# EAGLE design Dual_555_Police_Strobe (EAGLE 9.4.2)
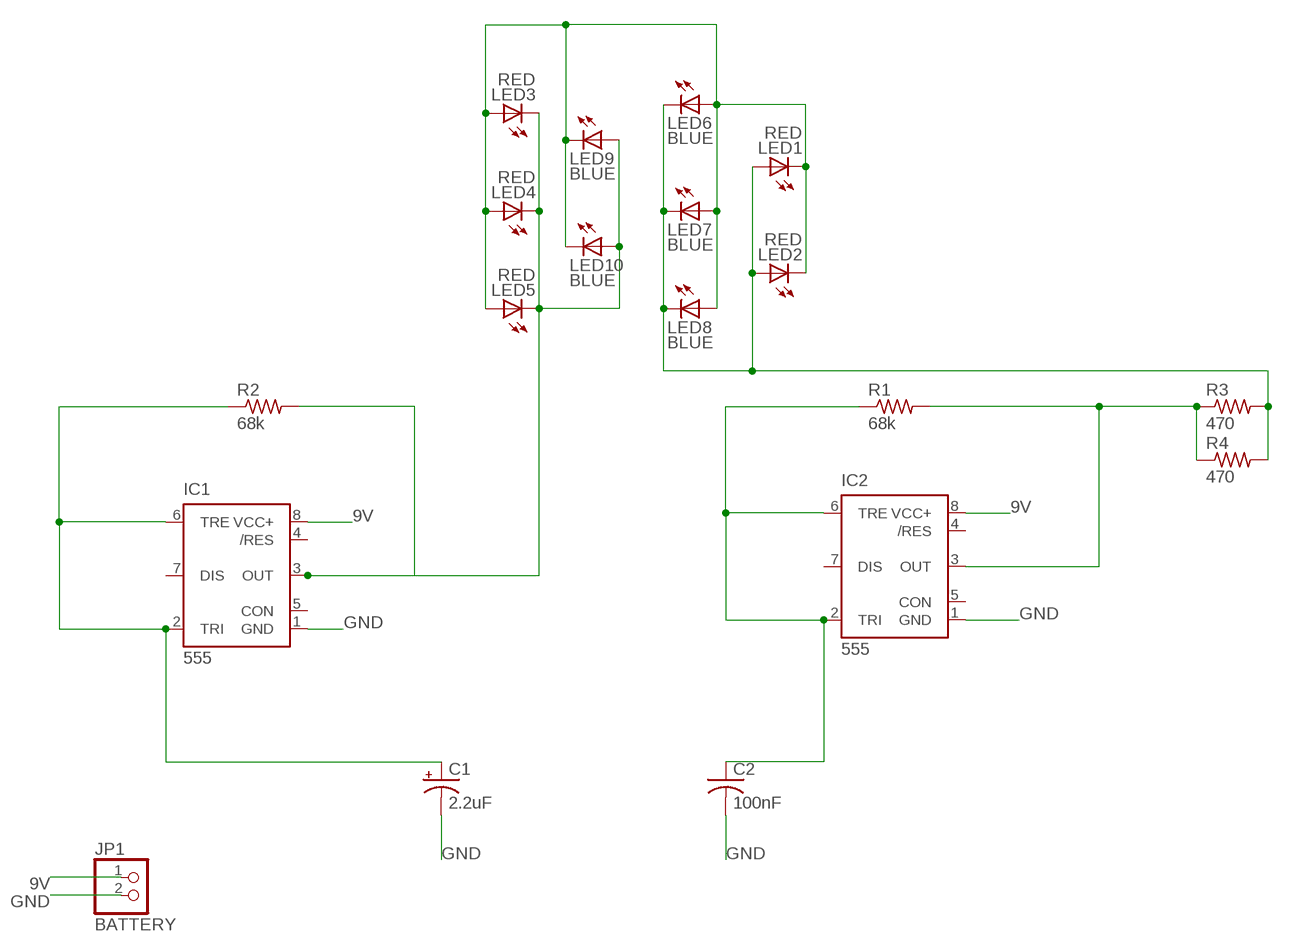
[diagram p0: schematic, sheet 1]

## Parts
C1  2.2uF  CPOL-USE2.5-6  [E2,5-6]
C2  100nF  C-US025-050X050  [C025-050X050]
IC1  555  555P  [DIP08]
IC2  555  555P  [DIP08]
JP1  BATTERY  PINHD-1X2  [1X02]
LED1  RED  LED5MM  [LED5MM]
LED2  RED  LED5MM  [LED5MM]
LED3  RED  LED5MM  [LED5MM]
LED4  RED  LED5MM  [LED5MM]
LED5  RED  LED5MM  [LED5MM]
LED6  BLUE  LED5MM  [LED5MM]
LED7  BLUE  LED5MM  [LED5MM]
LED8  BLUE  LED5MM  [LED5MM]
LED9  BLUE  LED5MM  [LED5MM]
LED10  BLUE  LED5MM  [LED5MM]
R1  68k  R-US_0207/10  [0207/10]
R2  68k  R-US_0207/10  [0207/10]
R3  470  R-US_0207/10  [0207/10]
R4  470  R-US_0207/10  [0207/10]

## Nets
9V: IC1.8(VCC+) IC2.8(VCC+) JP1.1
GND: C1.- C2.2 IC1.1(GND) IC2.1(GND) JP1.2
N$1: C1.+ IC1.2(TRI) IC1.6(TRE) R2.1
N$3: C2.1 IC2.2(TRI) IC2.6(TRE) R1.1
N$4: IC1.3(OUT) LED3.K(C) LED4.K(C) LED5.K(C) LED9.A LED10.A R2.2
N$5: LED1.A LED2.A LED6.K(C) LED7.K(C) LED8.K(C) R3.2 R4.2
N$6: IC2.3(OUT) R1.2 R3.1 R4.1
N$8: LED1.K(C) LED2.K(C) LED3.A LED4.A LED5.A LED6.A LED7.A LED8.A LED9.K(C) LED10.K(C)
Unconnected: IC1.4(/RES) IC1.5(CON) IC1.7(DIS) IC2.4(/RES) IC2.5(CON) IC2.7(DIS)

## Library data of the parts
C1 = adafruit:CPOL-US: POLARIZED CAPACITOR, American symbol
C2 = adafruit:C-US: CAPACITOR, American symbol
IC1 IC2 = SparkFun-IC-Special-Function:555: General purpose bipolar Timer Datasheet <http://www.sparkfun.com/datasheets/Components/General/ne555.pdf> SparkFun Products SparkFun SparkPunk Sequencer Kit <https://www.sparkfun.com/products/12707> (KIT-12707) Storefront Component: 555 Timer <https://www.sparkfun.com/products/9273> (COM-09273) Two parts valid for production: VFP: IC-11930 (M7555 PTH) VFP: IC-09173 (555 PTH) - Preferred; PROD_ID: IC-09173; PROD_ID_ALT: IC-09173
JP1 = pinhead:PINHD-1X2: PIN HEADER
LED1-LED10 = adafruit_copy:LED: LED OSRAM: - CHIPLED LG R971, LG N971, LY N971, LG Q971, LY Q971, LO R971, LY R971 LH N974, LH R974 LS Q976, LO Q976, LY Q976 LO Q996 - Hyper CHIPLED LW Q18S LB Q993, LB Q99A, LB R99A - SideLED LS A670, LO A670, LY A670, LG A670, LP A670 LB A673, LV A673, LT A673, LW A673 LH A674 LY A675 LS A676, LA A676, LO A676, LY A676, LW A676 LS A679, LY A679, LG A679 - Hyper Micro SIDELED® LS Y876, LA Y876, LO Y876, LY Y876 LT Y87S - SmartLED LW L88C, LW L88S LB L89C, LB L89S, LG L890 LS L89K, LO L89K, LY L89K LS L896, LA L896, LO L896, LY L896 - TOPLED LS T670, LO T670, LY T670, LG T670, LP T670 LSG T670, LSP T670, LSY T670, LOP T670, LYG T670 LG T671, LOG T671, LSG T671 LB T673, LV T673, LT T673, LW T673 LH T674 LS T676, LA T676, LO T676, LY T676, LB T676, LH T676, LSB T676, LW T676 LB T67C, LV T67C, LT T67C, LS T67K, LO T67K, LY T67K, LW E67C LS E67B, LA E67B, LO E67B, LY E67B, LB E67C, LV E67C, LT E67C LW T67C LS T679, LY T679, LG T679 LS T770, LO T770, LY T770, LG T770, LP T770 LB T773, LV T773, LT T773, LW T773 LH T774 LS E675, LA E675, LY E675, LS T675 LS T776, LA T776, LO T776, LY T776, LB T776 LHGB T686 LT T68C, LB T68C - Hyper Mini TOPLED® LB M676 - Mini TOPLED Santana® LG M470 LS M47K, LO M47K, LY M47K Source: http://www.osram.convergy.de/
R1-R4 = adafruit:R-US_: RESISTOR, American symbol

## Board
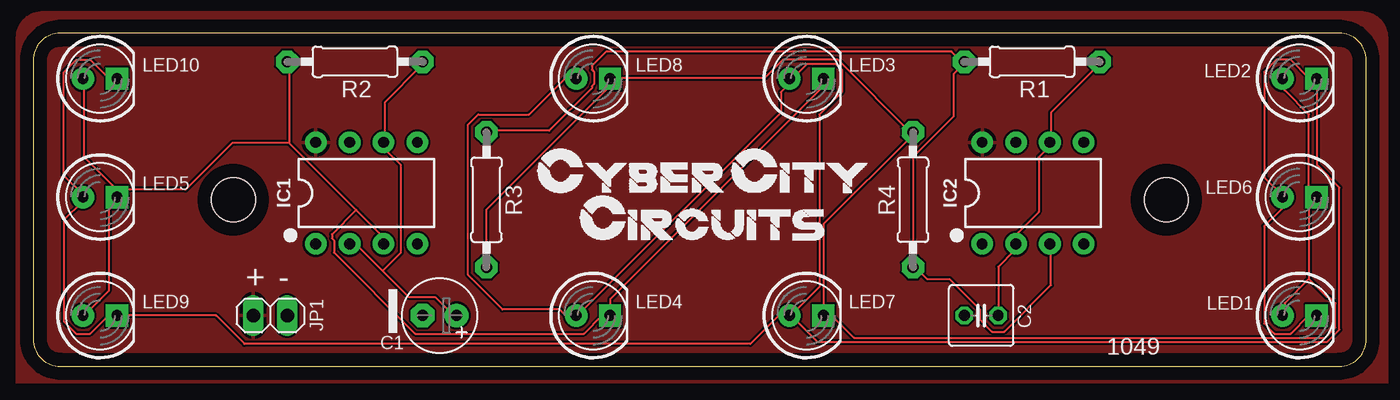
[diagram p1: board, top side]
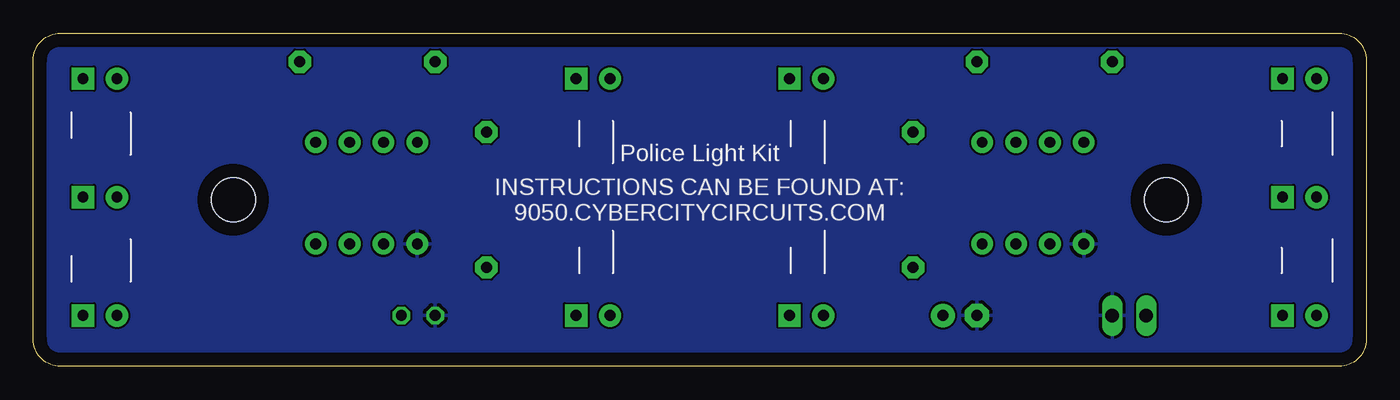
[diagram p2: board, bottom side, seen from below]

Size 100 x 25 mm. Coordinates in mm from the lower left corner, seen from the top.
Outline: 0,23 0,2 arc90 2,0 98,0 arc90 100,2 100,23 arc90 98,25 2,25 arc90 0,23
Copper layers (1*16): Top 0.035mm / dielectric 1.5mm / Bottom 0.035mm
Design rules "default": minimum track width 6mil, minimum drill 0.35mm, track to track 6mil, track to pad 6mil, pad to pad 6mil, via to via 6mil, smd to smd 6mil, copper to edge 40mil, drill to drill 6mil, minimum pad ring 10mil, minimum via ring 8mil, stop-mask expansion 4mil, vias tented up to drill 0mil, thermal gap 10mil
Holes 3.3 mm at 15,12.5 85,12.5

### Footprints (pad centres in the part's own frame; a part is rotated, then mirrored left to right if it is on the bottom)
E2,5-6 = drill 0.813 pad 1.778: + -1.27,0 | drill 0.813 pad 1.778 octagon: - 1.27,0
C025-050X050 = drill 0.813 octagon: 1 -1.27,0; 2 1.27,0
DIP08 = drill 0.813 pad 1.626: 1 -3.81,-3.81; 2 -1.27,-3.81; 3 1.27,-3.81; 4 3.81,-3.81; 5 3.81,3.81; 6 1.27,3.81; 7 -1.27,3.81; 8 -3.81,3.81
1X02 = drill 1.016 long: 1 -1.27,0; 2 1.27,0
LED5MM = drill 0.813 pad 1.676: A -1.27,0 | drill 0.813 pad 1.676 square: K 1.27,0
0207/10 = drill 0.813 pad 1.676 octagon: 1 -5.08,0; 2 5.08,0

### Placement (x,y rotation side)
C1  30.48,3.81 180 top
C2  71.12,3.81 180 top
IC1  25,13 0 top
IC2  75,13 0 top
JP1  17.78,3.81 0 top
LED1  95,3.81 0 top
LED2  95,21.59 0 top
LED3  58,21.59 0 top
LED4  42,3.81 0 top
LED5  5,12.7 0 top
LED6  95,12.7 0 top
LED7  58,3.81 0 top
LED8  42,21.59 0 top
LED9  5,3.81 0 top
LED10  5,21.59 0 top
R1  74.93,22.86 180 top
R2  24.13,22.86 180 top
R3  34,12.5 270 top
R4  66,12.5 90 top

### Tracks (layer width: path | path; a pad name or v marks a point on that pad's centre or on a via)
9V
  pour Top: -1.27,-1.27 -1.27,24.67 arc-90 0.73,26.67 99.06,26.67 99.6,26.67 arc-90 101.6,24.67 101.6,-1.27
GND
  pour Bottom: -2.54,-2.54 -2.54,25.94 arc-90 -0.54,27.94 101.6,27.94 arc-90 102.87,26.67 102.87,-2.54
N$1
  Top 0.152: R2.1 29.11,22.86 29.11,22.55 26.36,19.81 26.36,16.92 IC1.6 26.36,16.76 26.36,16.31 27.58,15.09 27.58,8.53 26.21,7.16 | 26.21,7.16 28.19,5.18 30.18,5.18 31.55,3.81 C1.+ | 26.21,7.16 24.23,9.14 23.77,9.14 IC1.2
N$3
  Top 0.152: C2.1 72.39,7.47 73.61,8.69 73.61,9.14 IC2.2 73.76,9.3 73.76,9.91 75.44,11.58 75.44,15.7 76.2,16.46 76.2,16.76 IC2.6 76.35,16.92 76.35,19.05 80.01,22.71 R1.1
N$4
  Top 0.152: LED3.K 59.13,21.49 59.13,20.88 43.28,5.03 43.28,3.81 LED4.K 42.67,3.81 41.3,2.44 28.65,2.44 22.55,8.53 22.55,9.45 22.4,9.6 22.4,9.91 24.23,11.73 | LED9.A 3.81,3.81 5.64,5.64 5.64,12.04 6.25,12.65 LED5.K | 6.25,13.26 3.81,15.7 3.81,21.49 LED10.A | 6.25,13.26 6.25,12.8 LED5.K | 19.2,16.76 24.23,11.73 | 24.23,11.73 26.21,9.75 26.21,9.3 IC1.3 | 19.2,16.76 19.2,22.71 R2.2 | 6.25,13.26 11.43,13.26 14.94,16.76 19.2,16.76 | 6.25,13.26 LED5.K
N$5
  Top 0.152: R3.2 33.98,7.47 33.98,11.73 43.13,20.88 43.13,21.49 LED8.K 43.28,21.64 54.86,21.64 56.24,23.01 60.35,23.01 65.99,17.37 | 95.71,6.55 93.88,4.72 93.88,3.81 LED1.A | 95.71,6.55 95.71,12.19 96.16,12.65 LED6.K 96.16,12.8 95.71,13.26 95.71,18.9 93.88,20.73 93.88,21.49 LED2.A | 59.28,3.81 59.28,10.67 65.99,17.37 | 65.99,17.37 66.14,17.53 R4.2 65.99,17.37 | 95.71,6.55 97.08,5.18 97.23,5.18 97.69,4.72 97.69,2.9 96.93,2.13 61.57,2.13 59.89,3.81 59.28,3.81 | 59.28,3.81 LED7.K
N$6
  Top 0.152: IC2.3 76.35,9.14 76.35,6.1 72.85,2.59 71.93,2.59 71.02,3.5 71.02,4.27 68.73,6.55 67.06,6.55 66.14,7.47 R4.1 65.99,7.47 65.99,15.7 69.04,18.75 69.04,21.95 69.95,22.86 R1.2 69.65,22.86 68.89,23.62 42.98,23.62 41.91,22.55 41.91,22.25 42.06,22.1 42.06,21.18 41.91,21.03 41.91,20.88 38.71,17.68 34.14,17.68 R3.1
N$8
  Top 0.152: LED1.K 95.71,3.81 94.34,2.44 93.12,2.44 92.35,3.2 92.35,10.52 93.73,11.89 93.73,12.65 LED6.A 93.73,12.8 92.35,14.17 92.35,22.1 93.27,23.01 94.34,23.01 95.71,21.64 96.16,21.64 LED2.K 96.32,21.49 96.32,15.09 97.99,13.41 97.99,2.74 97.08,1.83 58.83,1.83 56.84,3.81 | LED10.K 6.25,21.64 5.64,21.64 4.27,23.01 3.2,23.01 2.29,22.1 2.29,14.33 3.81,12.8 LED5.A 3.66,12.65 3.66,12.34 2.29,10.97 2.29,3.35 3.2,2.44 4.27,2.44 5.64,3.81 LED9.K 13.72,3.81 15.85,1.68 53.8,1.68 55.93,3.81 LED7.A 56.84,3.81 | LED8.A 40.69,21.64 39.93,21.64 37.19,18.9 33.38,18.9 32.61,18.14 32.61,6.86 35.2,4.27 39.47,4.27 39.93,3.81 LED4.A 40.84,3.81 56.08,19.05 56.08,20.57 56.69,21.18 56.69,21.49 LED3.A 56.84,21.49 58.06,22.71 60.2,22.71 60.66,22.25 60.66,20.57 58.98,18.9 58.98,5.94 56.84,3.81

### Text on the board
tPlace: + | - | 1049
bPlace: Police Light Kit | INSTRUCTIONS CAN BE FOUND AT: / 9050.CYBERCITYCIRCUITS.COM